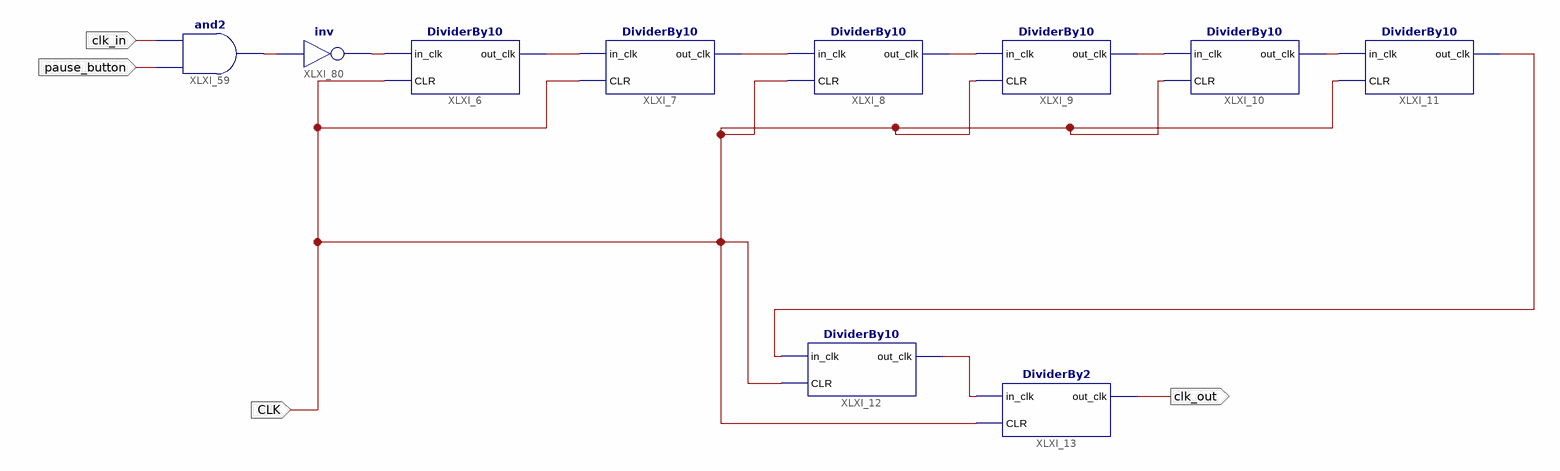
[diagram p0: schematic sheet 1]
// Xilinx ISE schematic Divider1Hz.sch (spartan6) as structural Verilog: 10 symbols, 4 ports
module Divider1Hz (
  input  CLK,
  input  clk_in,
  input  pause_button,
  output clk_out
);

  wire clk_divBy10, XLXN_6, XLXN_7, XLXN_8, XLXN_9, XLXN_10, XLXN_11, XLXN_114, XLXN_115;

  DividerBy10 XLXI_6 (.CLR(CLK), .in_clk(XLXN_114), .out_clk(clk_divBy10));
  DividerBy2 XLXI_13 (.CLR(CLK), .in_clk(XLXN_11), .out_clk(clk_out));
  DividerBy10 XLXI_12 (.CLR(CLK), .in_clk(XLXN_10), .out_clk(XLXN_11));
  DividerBy10 XLXI_11 (.CLR(CLK), .in_clk(XLXN_9), .out_clk(XLXN_10));
  DividerBy10 XLXI_10 (.CLR(CLK), .in_clk(XLXN_8), .out_clk(XLXN_9));
  DividerBy10 XLXI_9 (.CLR(CLK), .in_clk(XLXN_7), .out_clk(XLXN_8));
  DividerBy10 XLXI_8 (.CLR(CLK), .in_clk(XLXN_6), .out_clk(XLXN_7));
  DividerBy10 XLXI_7 (.CLR(CLK), .in_clk(clk_divBy10), .out_clk(XLXN_6));
  not XLXI_80 (XLXN_114, XLXN_115);
  and XLXI_59 (XLXN_115, pause_button, clk_in);
endmodule
